# Altium schematic sheet sch.SchDoc
size A4; SheetNumber: 1; SheetTotal: 1
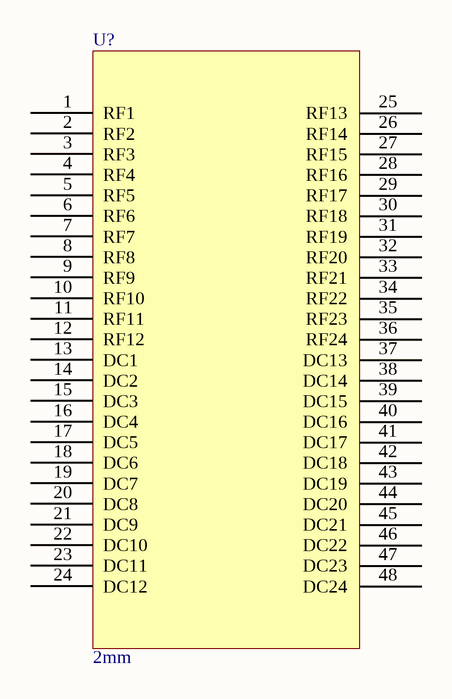
[diagram p0: sch.SchDoc]

## Parts
U?  2mm  [2mm]

## Nets

Not connected (* = marked no-connect by the designer): U? 1(RF1) 2(RF2) 3(RF3) 4(RF4) 5(RF5) 6(RF6) 7(RF7) 8(RF8) 9(RF9) 10(RF10) 11(RF11) 12(RF12) 13(DC1) 14(DC2) 15(DC3) 16(DC4) 17(DC5) 18(DC6) 19(DC7) 20(DC8) 21(DC9) 22(DC10) 23(DC11) 24(DC12) 25(RF13) 26(RF14) 27(RF15) 28(RF16) 29(RF17) 30(RF18) 31(RF19) 32(RF20) 33(RF21) 34(RF22) 35(RF23) 36(RF24) 37(DC13) 38(DC14) 39(DC15) 40(DC16) 41(DC17) 42(DC18) 43(DC19) 44(DC20) 45(DC21) 46(DC22) 47(DC23) 48(DC24)